# Altium schematic sheet lcd_keyb.SchDoc
size A4
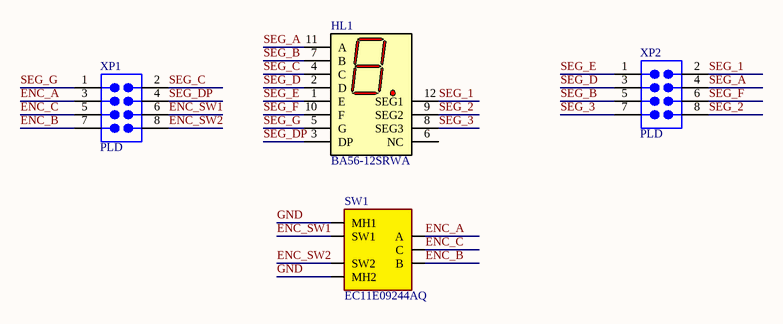
[diagram p0: lcd_keyb.SchDoc]

## Parts
HL1  BA56-12SRWA  [BX56-12]
SW1  EC11E09244AQ  [EC11E09244AQ]
XP1  PLD  [PLD-08R]
XP2  PLD  [PLD-08R]

## Nets
ENC_A: SW1.A XP1.3
ENC_B: SW1.B XP1.7
ENC_C: SW1.C XP1.5
ENC_SW1: SW1.SW1 XP1.6
ENC_SW2: SW1.SW2 XP1.8
GND: SW1.MH1 SW1.MH2
SEG_1: HL1.12(SEG1) XP2.2
SEG_2: HL1.9(SEG2) XP2.8
SEG_3: HL1.8(SEG3) XP2.7
SEG_A: HL1.11(A) XP2.4
SEG_B: HL1.7(B) XP2.5
SEG_C: HL1.4(C) XP1.2
SEG_D: HL1.2(D) XP2.3
SEG_DP: HL1.3(DP) XP1.4
SEG_E: HL1.1(E) XP2.1
SEG_F: HL1.10(F) XP2.6
SEG_G: HL1.5(G) XP1.1

Not connected (* = marked no-connect by the designer): HL1 6(NC)

## Library data of the parts
HL1 = BA56-12SRWA: Table: Seven Segment Displays; Part Number: BA56-12SRWA; Device: BA56-12SRWA
SW1 = EC11E09244AQ: Table: Button; Part Number: EC11E09244AQ; Device: EC11E09244AQ
XP1 XP2 = PLD-08R: Table: AUK; Part Number: PLD-08R; Family: PLD